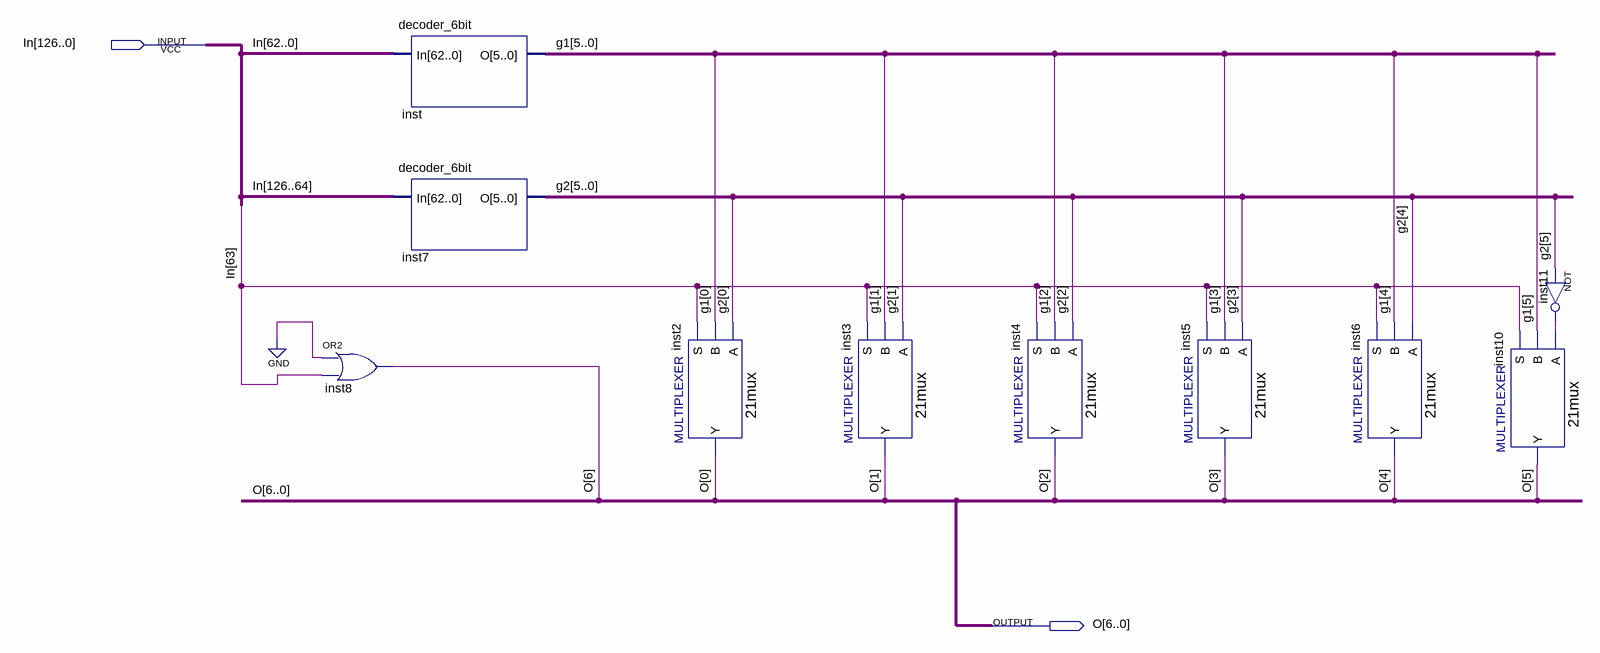
[diagram p0: schematic sheet]
// Quartus schematic decoder_7bit.bdf as structural Verilog: 10 symbols, 2 pins
module decoder_7bit (
  input  [126:0] In,
  output [6:0] O
);

  wire inst11_out;
  wire [5:0] g1, g2;

  or inst8 (O[6], 1'b0, In[63]);
  decoder_6bit inst (.In(In[62:0]), .O(g1));
  decoder_6bit inst7 (.In(In[126:64]), .O(g2));
  \21mux  inst2 (.S(In[63]), .B(g1[0]), .A(g2[0]), .Y(O[0]));
  \21mux  inst3 (.S(In[63]), .B(g1[1]), .A(g2[1]), .Y(O[1]));
  \21mux  inst4 (.S(In[63]), .B(g1[2]), .A(g2[2]), .Y(O[2]));
  \21mux  inst5 (.S(In[63]), .B(g1[3]), .A(g2[3]), .Y(O[3]));
  \21mux  inst6 (.S(In[63]), .B(g1[4]), .A(g2[4]), .Y(O[4]));
  \21mux  inst10 (.S(In[63]), .B(g1[5]), .A(inst11_out), .Y(O[5]));
  not inst11 (inst11_out, g2[5]);
endmodule
